# Altium project panel.PrjPCB
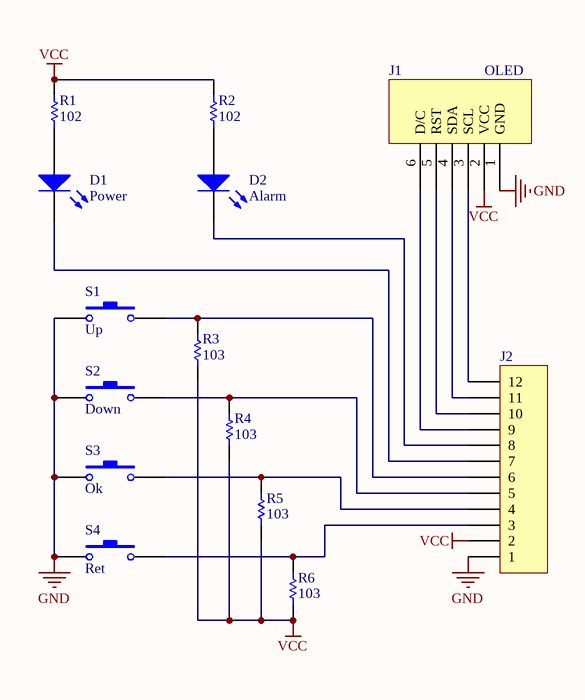
[diagram p0: panel.SchDoc]
1 sheet, 14 parts. Net scope: global (net labels, ports and power ports of the same name join across sheets).
Board file: panel.PcbDoc

## Sheet panel.SchDoc
size A4

### Parts
D1  Power  [LED-2P]
D2  Alarm  [LED-2P]
J1  OLED  [OLED]
J2  (no value)  [XH2.54-12P]
R1  102  [0805]
R2  102  [0805]
R3  103  [0805]
R4  103  [0805]
R5  103  [0805]
R6  103  [0805]
S1  Up  [SW-PB]
S2  Down  [SW-PB]
S3  Ok  [SW-PB]
S4  Ret  [SW-PB]

### Nets
GND: J1.1(GND) J2.1 S1.1 S2.1 S3.1 S4.1
VCC: J1.2(VCC) J2.2 R1.1 R2.2 R3.1 R4.1 R5.1 R6.1
NetD1_1: D1.1(A) R1.2
NetD1_2: D1.2(K) J2.7
NetD2_1: D2.1(A) R2.1
NetD2_2: D2.2(K) J2.8
NetJ1_3: J1.3(SCL) J2.12
NetJ1_4: J1.4(SDA) J2.11
NetJ1_5: J1.5(RST) J2.10
NetJ1_6: J1.6(D/C) J2.9
NetJ2_3: J2.3 R6.2 S4.2
NetJ2_4: J2.4 R5.2 S3.2
NetJ2_5: J2.5 R4.2 S2.2
NetJ2_6: J2.6 R3.2 S1.2

### Library data of the parts
D1 D2 = LED: Typical INFRARED GaAs LED; Published: *; LatestRevisionDate: *; LatestRevisionNote: *; Publisher: *
J2 = Header 12: Header, 12-Pin; LatestRevisionDate: 17-Jul-2002; LatestRevisionNote: Re-released for DXP Platform.; Publisher: Altium Limited
R1-R6 = Res: Resistor
  R1 R2: Published: *; LatestRevisionDate: *; LatestRevisionNote: *; Publisher: *
  R3-R6: Published: 8-Jun-2000; LatestRevisionDate: 17-Jul-2002; LatestRevisionNote: Re-released for DXP Platform.; Publisher: Altium Limited
S1-S4 = SW-PB: Switch; Published: *; LatestRevisionDate: *; LatestRevisionNote: *; Publisher: *